# Altium schematic sheet Blinky.SchDoc
size 297 x 210 mm
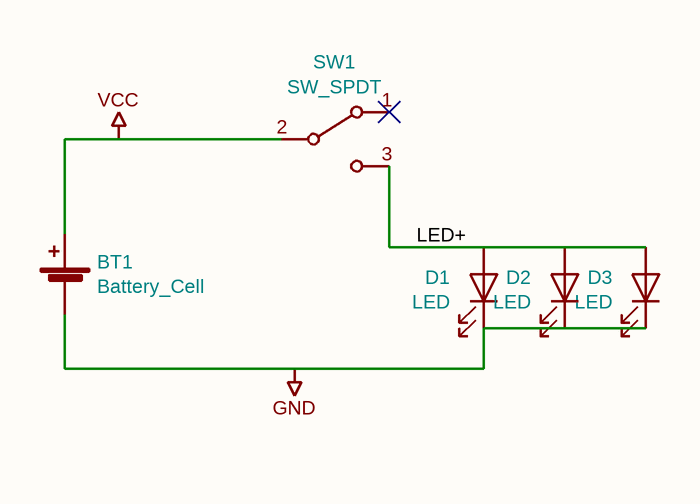
[diagram p0: Blinky.SchDoc]

## Parts
BT1  Battery_Cell  [BatteryHolder_MPD_BK888_2032_THRU]
D1  LED  [LED_D5.0mm]
D2  LED  [LED_D5.0mm]
D3  LED  [LED_D5.0mm]
SW1  SW_SPDT  [SW_CuK_OS102011MA1QN1_SPDT_Angled]

## Nets
GND: BT1.2(-) D1.1(K) D2.1(K) D3.1(K)
VCC: BT1.1(+) SW1.2(B)
LED+: D1.2(A) D2.2(A) D3.2(A) SW1.3(C)

Not connected (* = marked no-connect by the designer): SW1 1(A)*

## Notes on the sheet
- 1
- 2
- 3
- 4
- 5
- 6
- A
- B
- C
- D
- Title:
- File: Blinky.sch
- Sheet: /
- KiCad E.D.A.  kicad (5.1.4)-1
- Size: A4
- Date:
- Rev:
- Id: 1/1

## Library data of the parts
BT1 = Battery_Cell: Value: Battery_Cell; Footprint: BlinkyBadge:BatteryHolder_MPD_BK888_2032_THRU
D1-D3 = LED: Value: LED; Footprint: LED_THT:LED_D5.0mm
SW1 = SW_SPDT: Value: SW_SPDT; Footprint: Button_Switch_THT:SW_CuK_OS102011MA1QN1_SPDT_Angled